# Altium project PAY_IFB.PrjPcb (part 1 of 7)
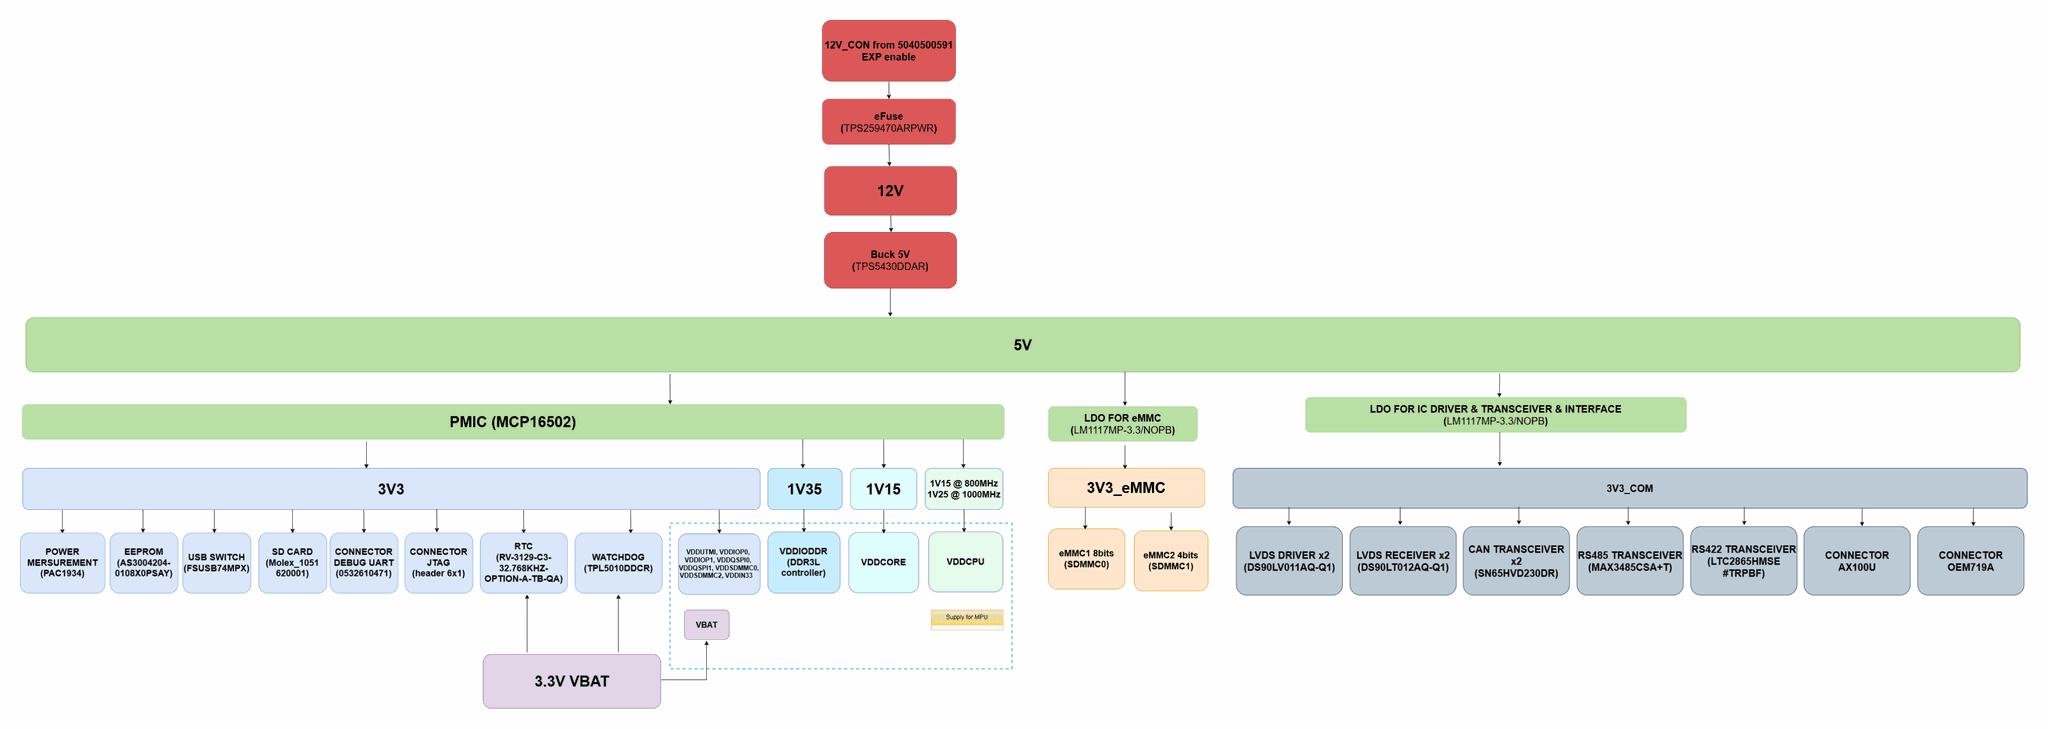
[diagram p0: PowerTree.SchDoc]
23 sheets, 545 parts. Net scope: flat (ports and power ports of the same name join across sheets).
Board file: PAY_IFP_V1.PcbDoc
Sheets:
  PowerTree.SchDoc
  BlockDiagram.SchDoc
  POWER.SchDoc
  CONNECTOR_EXP.SchDoc
  CONNECTOR_INTERFACE.SchDoc
  SAMA7D65_PMIC.SchDoc
  SAMA7D65_MPU.SchDoc
  SAMA7D65_PIO.SchDoc
  SAMA7D65_DDR3L.SchDoc
  SDCARD.SchDoc
  eMMC.SchDoc
  EEPROM.SchDoc
  USB_SWITCH.SchDoc
  DEBUG_CONSOLE.SchDoc
  TEMP.SchDoc
  RTC.SchDoc
  WATCHDOG.SchDoc
  LVDS.SchDoc
  CAN_PHY.SchDoc
  RS485.SchDoc
  RS422.SchDoc
  BUTTON_LED.SchDoc
  MOUNTING_HOLE.SchDoc

## Sheet PowerTree.SchDoc
size A3; SheetNumber: 1; SheetTotal: 23

### Notes on the sheet
- Project:
- Page Contents:
- Revision:
- Design:
- Date:
- Size:
- A3
- Document Number:
- Sheet:
- of

## Sheet BlockDiagram.SchDoc
size 420 x 297 mm; SheetNumber: 2; SheetTotal: 23
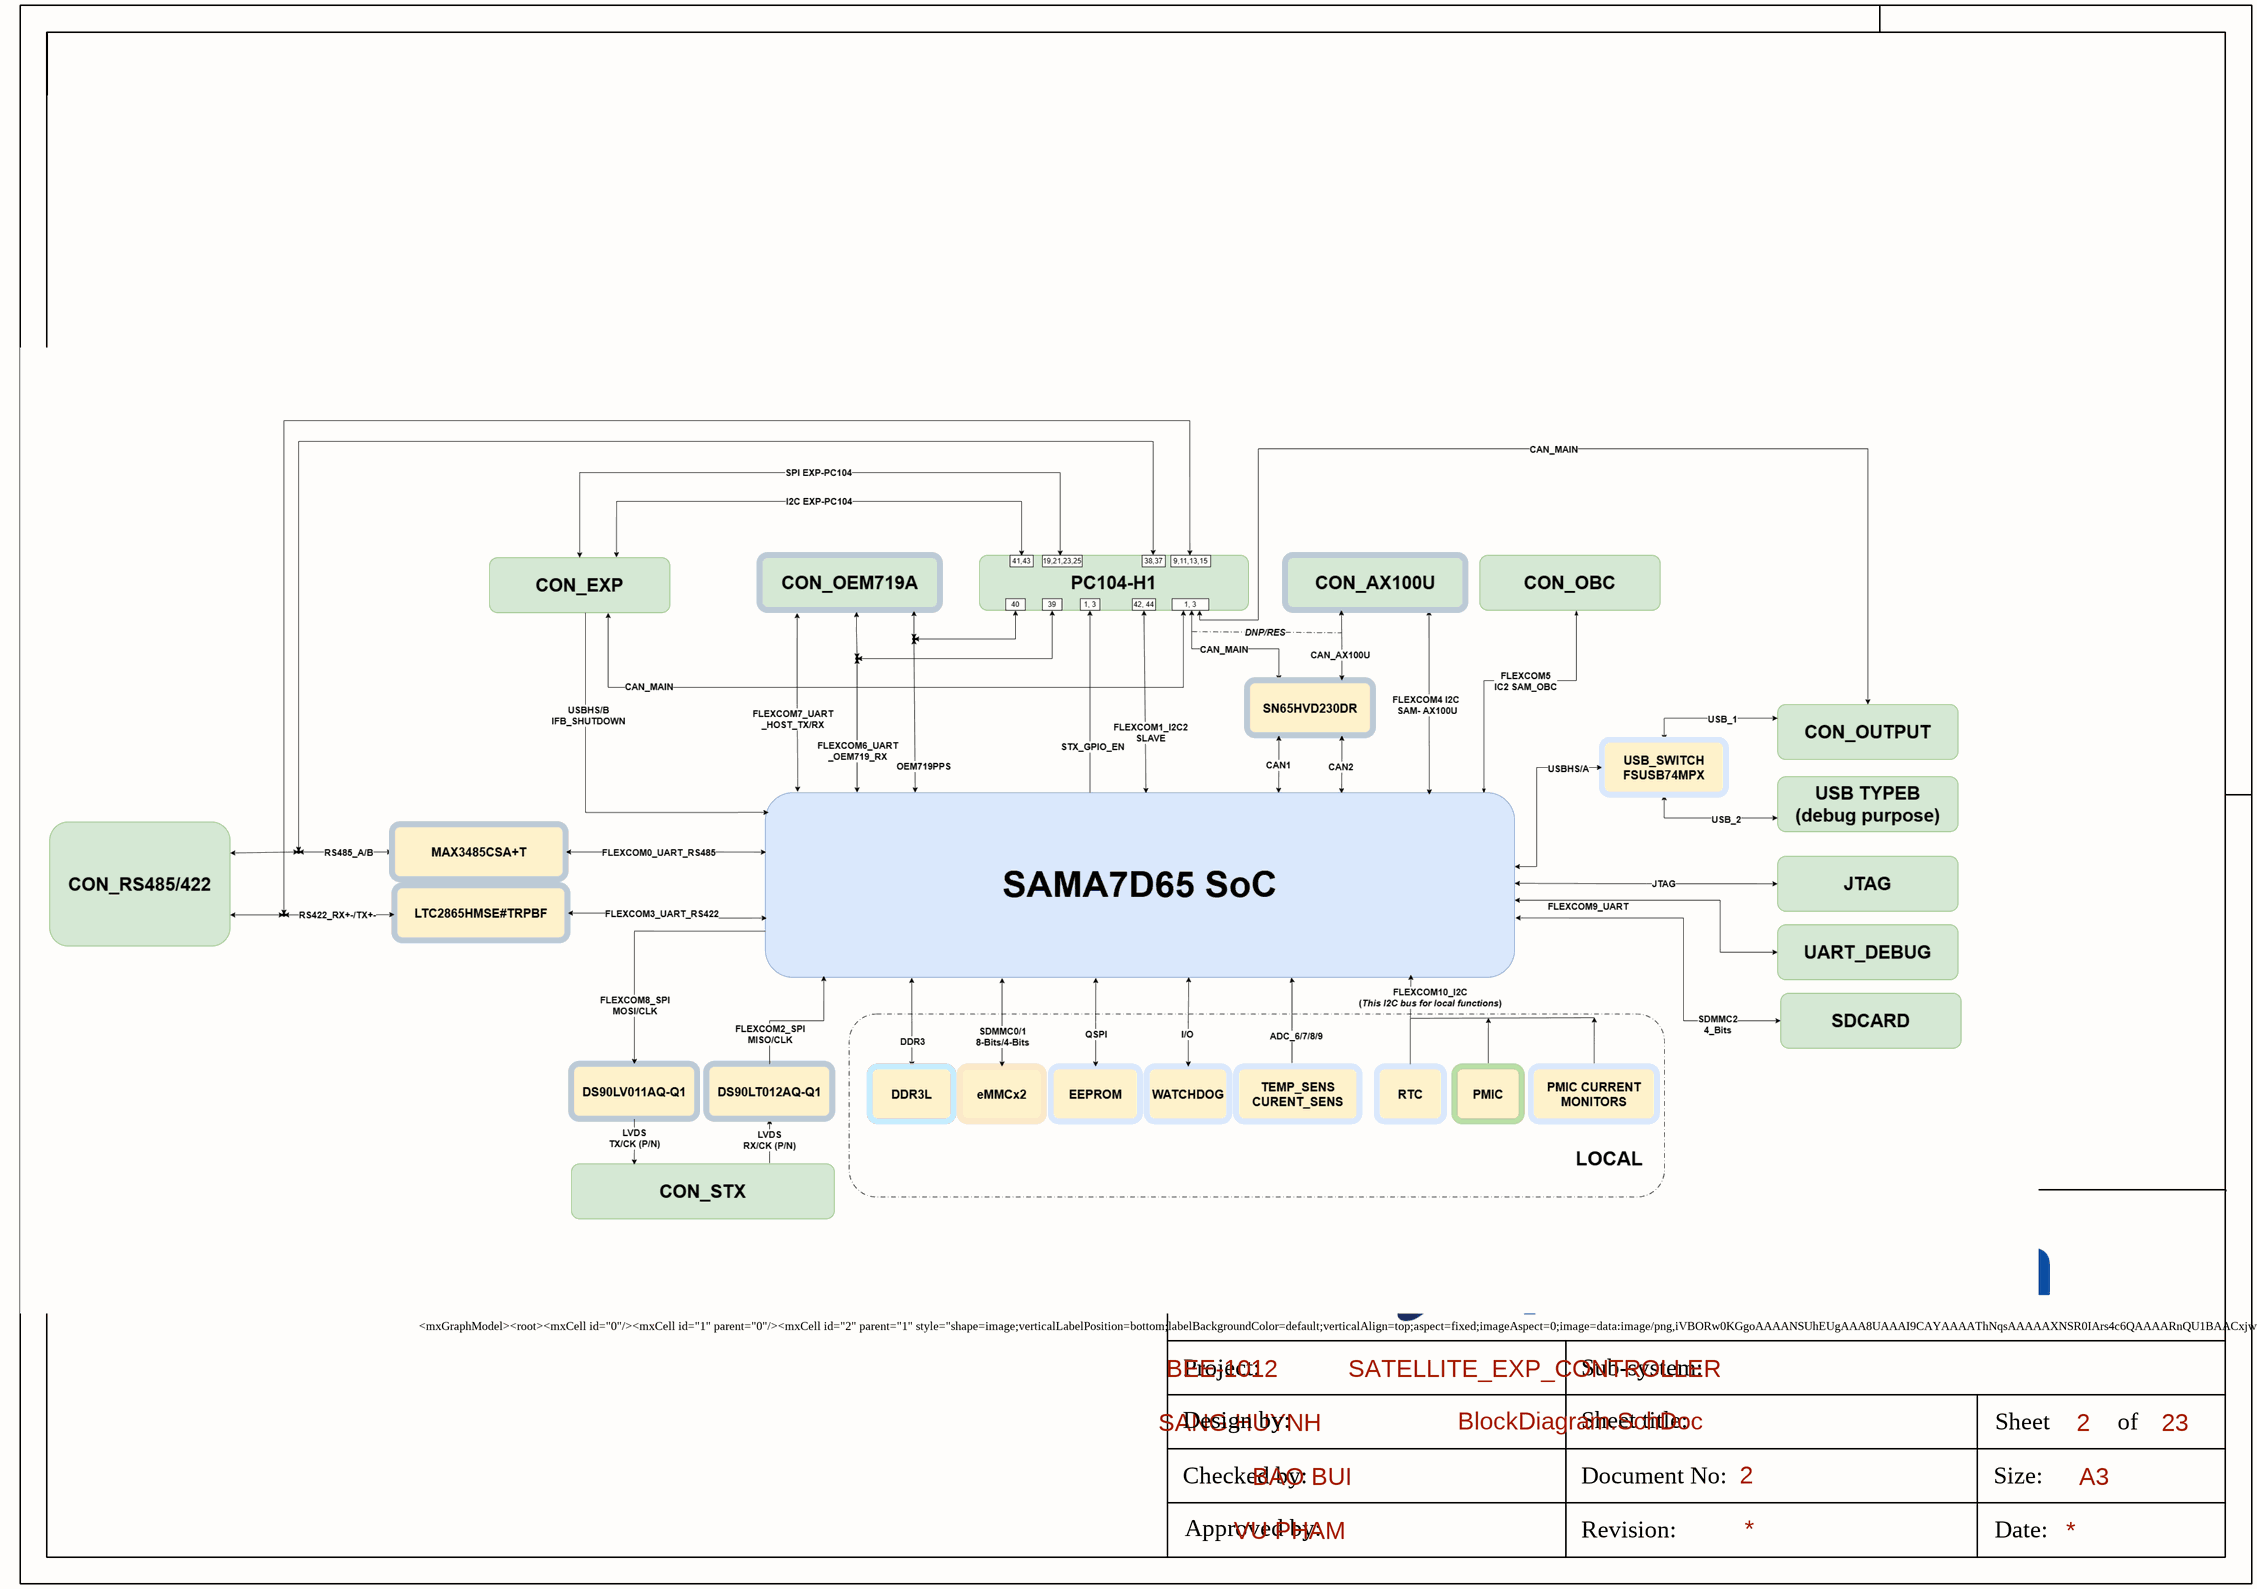
[diagram p1: BlockDiagram.SchDoc]
### Notes on the sheet